# EAGLE design Robot Arm Board (EAGLE 7.6.0)
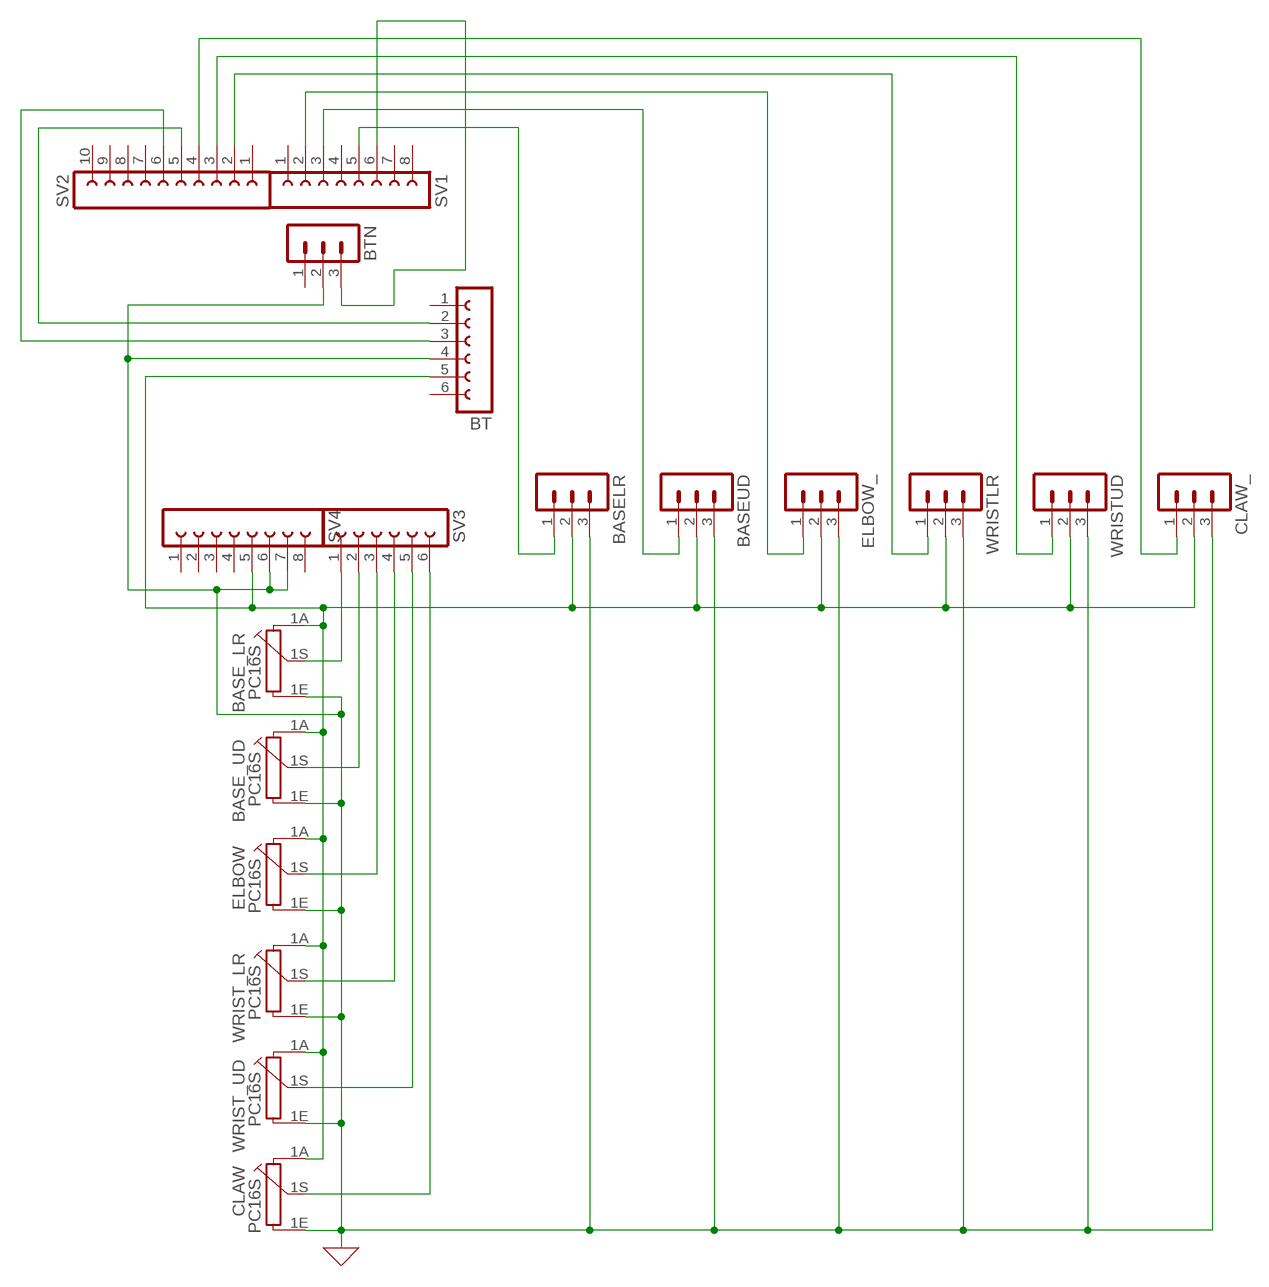
[diagram p0: schematic, sheet 1]

## Parts
BASE_LR  PC16S  [PC16S]
BASE_UD  PC16S  [PC16S]
BASELR  MA03-1  [MA03-1]
BASEUD  MA03-1  [MA03-1]
BT  FE06-1  [FE06]
BTN  MA03-1  [MA03-1]
CLAW  PC16S  [PC16S]
CLAW_  MA03-1  [MA03-1]
ELBOW  PC16S  [PC16S]
ELBOW_  MA03-1  [MA03-1]
SV1  FE08-1  [FE08]
SV2  FE10-1  [FE10]
SV3  FE06-1  [FE06]
SV4  FE08-1  [FE08]
WRIST_LR  PC16S  [PC16S]
WRIST_UD  PC16S  [PC16S]
WRISTLR  MA03-1  [MA03-1]
WRISTUD  MA03-1  [MA03-1]

## Nets
GND: BASE_LR.1E BASE_UD.1E BASELR.3 BASEUD.3 BT.4 BTN.2 CLAW.1E CLAW_.3 ELBOW.1E ELBOW_.3 SV4.6 SV4.7 WRIST_LR.1E WRIST_UD.1E WRISTLR.3 WRISTUD.3
N$1: BASE_LR.1S SV3.1
N$2: BASE_UD.1S SV3.2
N$3: ELBOW.1S SV3.3
N$4: SV3.4 WRIST_LR.1S
N$5: SV3.5 WRIST_UD.1S
N$6: CLAW.1S SV3.6
N$7: SV2.3 WRISTUD.1
N$8: BASELR.1 SV1.5
N$9: BASEUD.1 SV1.3
N$10: ELBOW_.1 SV1.2
N$11: SV2.2 WRISTLR.1
N$12: BASE_LR.1A BASE_UD.1A BASELR.2 BASEUD.2 BT.5 CLAW.1A CLAW_.2 ELBOW.1A ELBOW_.2 SV4.5 WRIST_LR.1A WRIST_UD.1A WRISTLR.2 WRISTUD.2
N$13: CLAW_.1 SV2.4
N$14: BTN.3 SV1.6
N$15: BT.2 SV2.5
N$16: BT.3 SV2.6
Unconnected: BT.1 BT.6 BTN.1 SV1.1 SV1.4 SV1.7 SV1.8 SV2.1 SV2.7 SV2.8 SV2.9 SV2.10 SV4.1 SV4.2 SV4.3 SV4.4 SV4.8

## Library data of the parts
BASE_LR BASE_UD CLAW ELBOW WRIST_LR WRIST_UD = piher:PC16S: POTENTIOMETER single carbon potentiometer, 16 mm, S3ROH; OC_FARNELL: 4452940; OC_NEWARK: unknown
BASELR BASEUD BTN CLAW_ ELBOW_ WRISTLR WRISTUD = con-lstb:MA03-1: PIN HEADER; OC_FARNELL: unknown; OC_NEWARK: unknown
BT SV3 = con-lsta:FE06-1: FEMALE HEADER; OC_FARNELL: unknown; OC_NEWARK: unknown
SV1 SV4 = con-lsta:FE08-1: FEMALE HEADER; OC_FARNELL: unknown; OC_NEWARK: unknown
SV2 = con-lsta:FE10-1: FEMALE HEADER; OC_FARNELL: unknown; OC_NEWARK: unknown

## Board
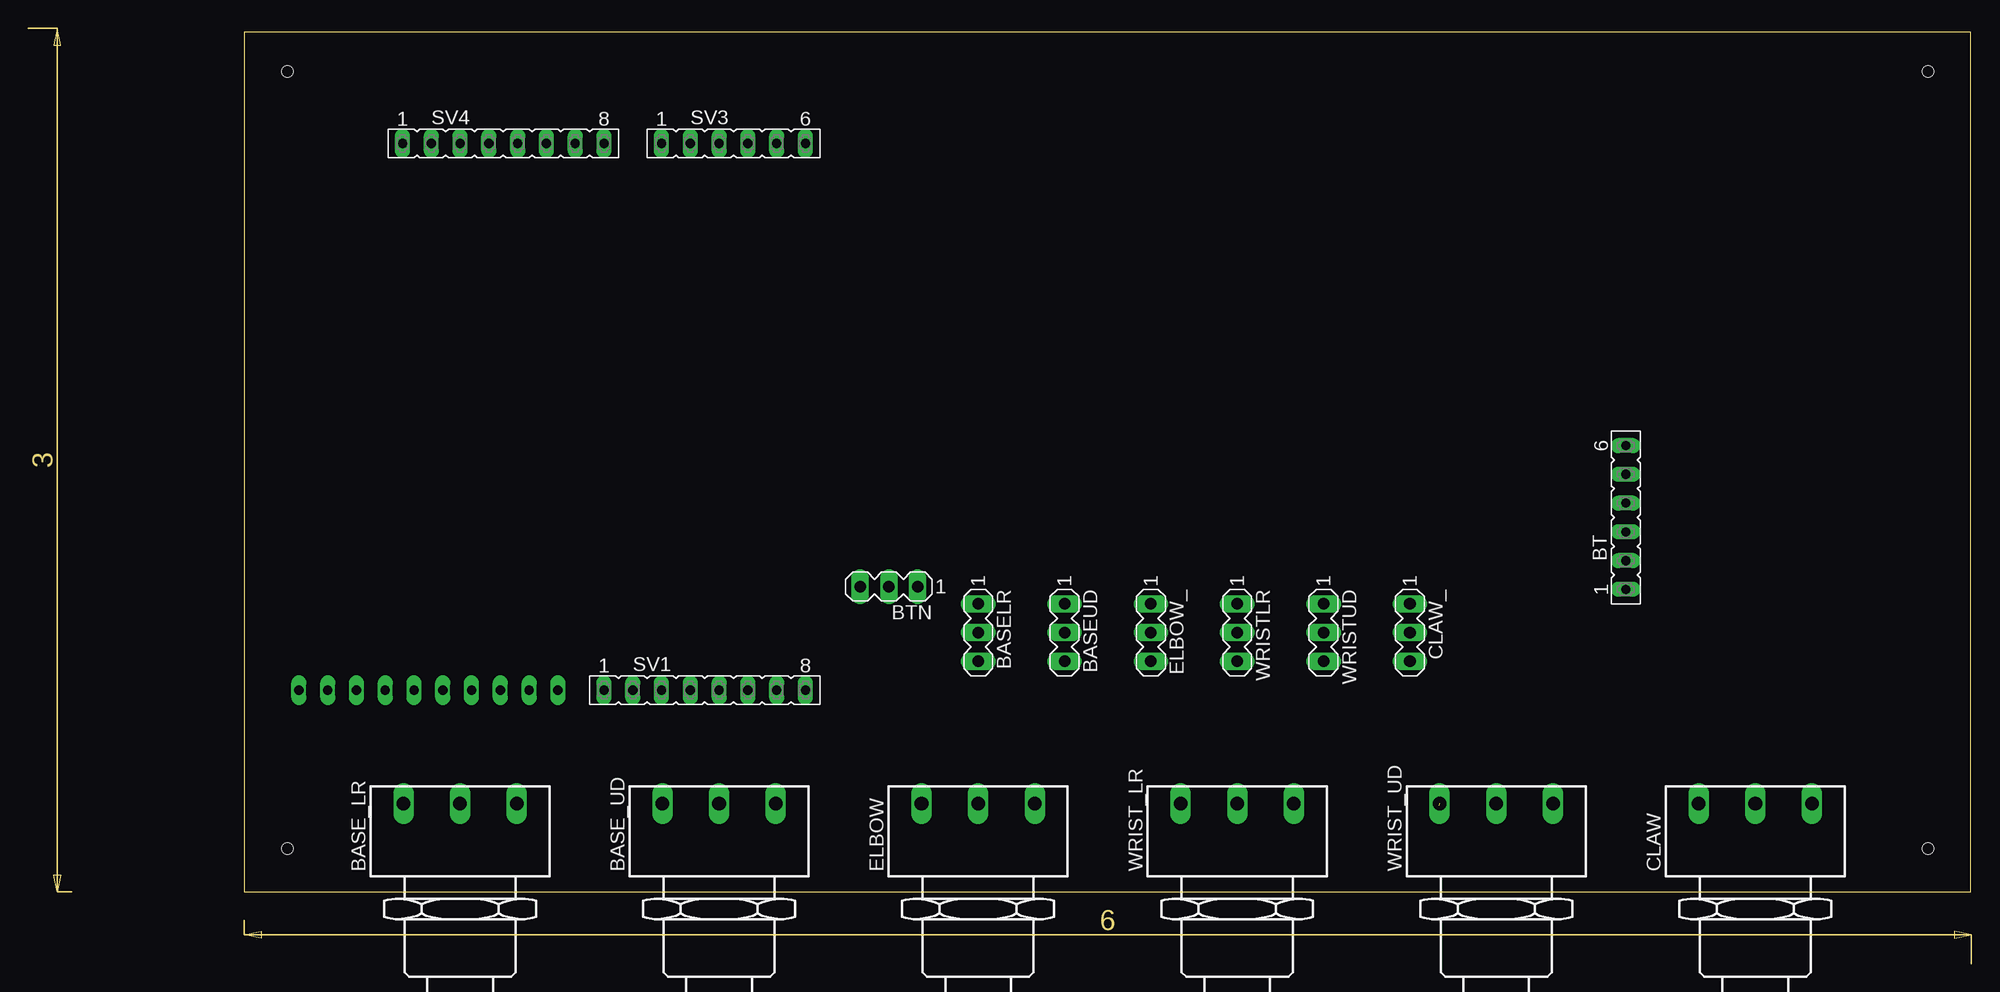
[diagram p1: board, top side]
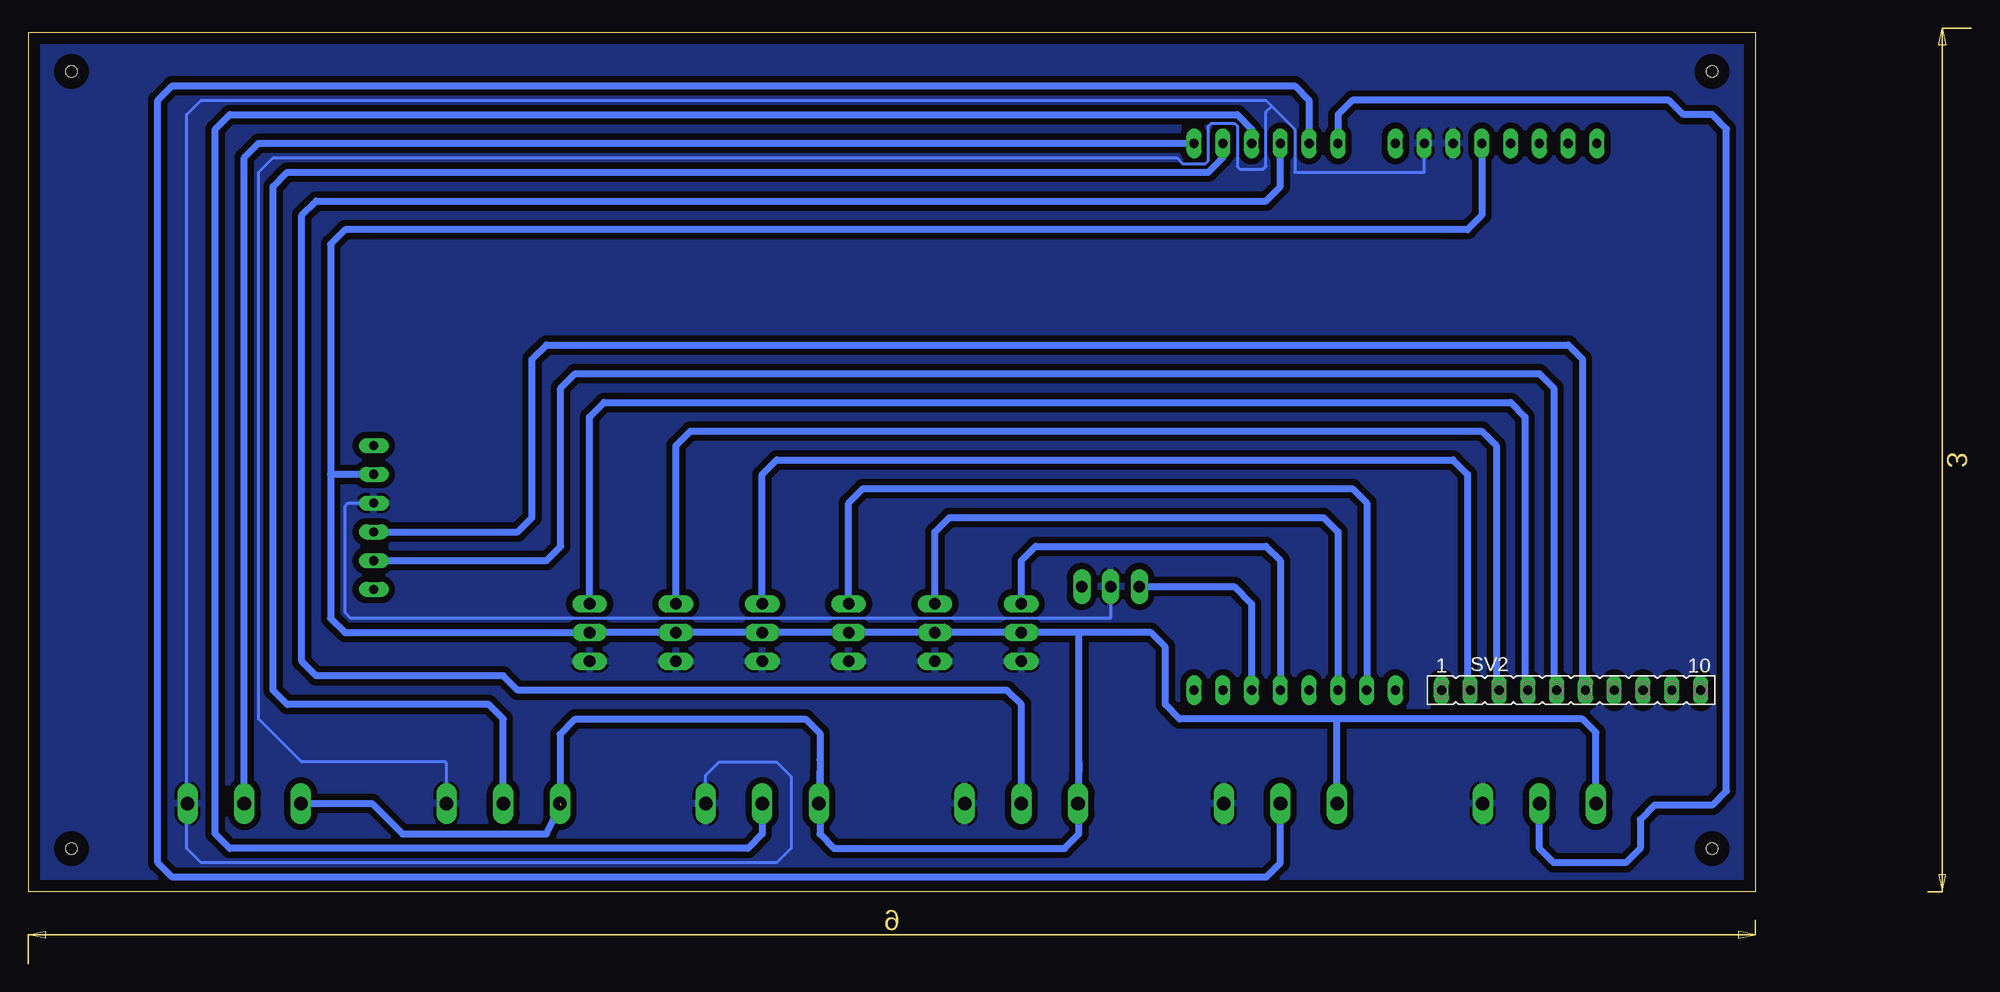
[diagram p2: board, bottom side, seen from below]

Size 152.38 x 75.87 mm. Coordinates in mm from the lower left corner, seen from the top.
Outline: 0,0 152.38,0 152.38,75.87 0,75.87 0,0
Copper layers (1*16): Top 0.035mm / dielectric 1.5mm / Bottom 0.035mm
Design rules "default *": minimum track width 6mil, minimum drill 0.35mm, track to track 22mil, track to pad 22mil, pad to pad 22mil, via to via 22mil, smd to smd 22mil, copper to edge 40mil, drill to drill 6mil, minimum pad ring 10mil, minimum via ring 8mil, stop-mask expansion 4mil, vias tented up to drill 0mil, thermal gap 10mil
Holes 1 mm at 148.59,3.81 148.59,72.39 3.81,3.81 3.81,72.39

### Footprints (pad centres in the part's own frame; a part is rotated, then mirrored left to right if it is on the bottom)
PC16S = drill 1.2 long: 1A -5,6.5; 1E 5,6.5; 1S 0,6.5
MA03-1 = drill 1.016 long: 1 -2.54,0; 2 0,0; 3 2.54,0
FE06 = drill 0.813 long: 1 -6.35,0; 2 -3.81,0; 3 -1.27,0; 4 1.27,0; 5 3.81,0; 6 6.35,0
FE08 = drill 0.813 long: 1 -8.89,0; 2 -6.35,0; 3 -3.81,0; 4 -1.27,0; 5 1.27,0; 6 3.81,0; 7 6.35,0; 8 8.89,0
FE10 = drill 0.813 long: 1 -11.43,0; 2 -8.89,0; 3 -6.35,0; 4 -3.81,0; 5 -1.27,0; 6 1.27,0; 7 3.81,0; 8 6.35,0; 9 8.89,0; 10 11.43,0

### Placement (x,y rotation side)
BASE_LR  19.05,1.27 0 top
BASE_UD  41.91,1.27 0 top
BASELR  64.77,22.86 270 top
BASEUD  72.39,22.86 270 top
BT  121.92,33.02 90 top
BTN  56.9,26.92 180 top
CLAW  133.35,1.27 0 top
CLAW_  102.87,22.86 270 top
ELBOW  64.77,1.27 0 top
ELBOW_  80.01,22.86 270 top
SV1  40.64,17.78 0 top
SV2  16.26,17.78 0 bottom
SV3  43.18,66.04 0 top
SV4  22.86,66.04 0 top
WRIST_LR  87.63,1.27 0 top
WRIST_UD  110.49,1.27 0 top
WRISTLR  87.63,22.86 270 top
WRISTUD  95.25,22.86 270 top

### Tracks (layer width: path | path; a pad name or v marks a point on that pad's centre or on a via)
GND
  Bottom 0.254: WRIST_LR.1E 92.63,10.24 91.44,11.43 86.36,11.43 85.09,10.16 85.09,3.81 86.36,2.54 137.16,2.54 138.43,3.81 138.43,68.58 137.16,69.85 43.18,69.85 42.67,69.34 | 42.67,69.34 40.64,67.31 40.64,63.5 29.21,63.5 SV4.7 | WRIST_UD.1E 115.49,11.35 115.57,11.43 128.27,11.43 132.08,15.24 132.08,63.5 130.81,64.77 51.05,64.77 50.55,64.26 48.51,64.26 48.26,64.52 48.26,67.56 48.01,67.82 45.97,67.82 45.72,67.56 45.72,64.01 45.47,63.75 43.43,63.75 43.18,64.01 43.18,68.83 42.67,69.34 | BTN.2 56.9,24.13 123.95,24.13 124.46,24.64 124.46,34.04 124.21,34.29 BT.4
  pour Bottom: 0,0 152.4,0 152.4,76.2 0,76.2
  pour Bottom: 0,0 152.4,0 152.4,76.2 0,76.2
N$1
  Bottom 0.61: SV3.1 36.83,68.58 35.56,69.85 7.62,69.85 6.35,68.58 3.81,68.58 2.54,67.31 2.54,8.89 3.81,7.62 8.89,7.62 10.16,6.35 10.16,3.81 11.43,2.54 17.78,2.54 19.05,3.81 BASE_LR.1S
N$2
  Bottom 0.61: SV3.2 39.37,69.85 40.64,71.12 139.7,71.12 140.97,69.85 140.97,2.54 139.7,1.27 43.18,1.27 41.91,2.54 BASE_UD.1S
N$3
  Bottom 0.61: ELBOW.1S 64.77,16.51 66.04,17.78 109.22,17.78 110.49,19.05 127,19.05 128.27,20.32 128.27,59.69 127,60.96 43.18,60.96 41.91,62.23 SV3.3
N$4
  Bottom 0.61: SV3.4 44.45,67.31 45.72,68.58 134.62,68.58 135.89,67.31 135.89,5.08 134.62,3.81 88.9,3.81 87.63,5.08 WRIST_LR.1S
N$5
  Bottom 0.61: WRIST_UD.1S 110.49,15.24 111.76,16.51 129.54,16.51 130.81,17.78 130.81,62.23 129.54,63.5 48.26,63.5 46.99,64.77 SV3.5
N$6
  Bottom 0.61: CLAW.1S 133.35,64.77 132.08,66.04 SV3.6
N$7
  Bottom 0.61: WRISTUD.1 95.25,39.37 93.98,40.64 24.13,40.64 22.86,39.37 22.86,18.03 SV2.3
N$8
  Bottom 0.61: BASELR.1 64.77,29.21 63.5,30.48 43.18,30.48 41.91,29.21 SV1.5
N$9
  Bottom 0.61: BASEUD.1 72.39,31.75 71.12,33.02 38.1,33.02 36.83,31.75 SV1.3
N$10
  Bottom 0.61: ELBOW_.1 80.01,34.29 78.74,35.56 35.56,35.56 34.29,34.29 SV1.2
N$11
  Bottom 0.61: WRISTLR.1 87.63,36.83 86.36,38.1 26.67,38.1 25.4,36.83 25.4,18.03 SV2.2
N$12  (1 unrouted)
  Bottom 0.61: SV4.5 24.13,59.69 25.4,58.42 124.46,58.42 125.73,57.15 125.73,36.83 | 125.73,36.83 125.73,24.13 124.46,22.86 CLAW_.2 WRISTUD.2 WRISTLR.2 ELBOW_.2 BASEUD.2 BASELR.2 59.69,22.86 | 82.55,5.08 82.63,8.97 WRIST_LR.1A 82.55,11.66 | 59.69,11.5 59.69,5.08 60.96,3.81 81.28,3.81 82.55,5.08 | 59.69,11.5 ELBOW.1A | 82.55,11.66 82.55,13.97 83.82,15.24 104.14,15.24 105.49,13.89 WRIST_UD.1A | BASE_LR.1A 14.05,14.05 15.24,15.24 36.83,15.24 | 36.83,15.24 50.8,15.24 52.07,16.51 52.07,21.59 53.34,22.86 59.69,22.86 | BASE_UD.1A 36.91,15.16 36.83,15.24 | 82.55,11.66 82.55,5.08 | 59.69,11.5 59.69,22.86 | 105.41,7.62 106.68,5.08 119.38,5.08 122.07,7.77 CLAW.1A | BT.5 125.73,36.83
N$13
  Bottom 0.61: CLAW_.1 102.87,41.91 101.6,43.18 21.59,43.18 20.32,41.91 20.32,18.03 SV2.4
N$14
  Bottom 0.61: BTN.3 45.97,26.92 44.45,25.4 SV1.6
N$15
  Bottom 0.61: BT.2 106.68,29.21 105.41,30.48 105.41,44.45 104.14,45.72 19.05,45.72 17.78,44.45 17.78,18.03 SV2.5
N$16
  Bottom 0.61: BT.3 109.22,31.75 107.95,33.02 107.95,46.99 106.68,48.26 16.51,48.26 15.24,46.99 15.24,18.03 SV2.6
NULL
  pour Bottom: 0,0 152.4,0 152.4,76.2 0,76.2